# Altium schematic sheet Ethernet.SchDoc: Ethernet
size A3; DocumentNumber: MB1246; Revision: B.1; SheetNumber: 7; SheetTotal: 17; Project: STM32H7xxI-EVAL
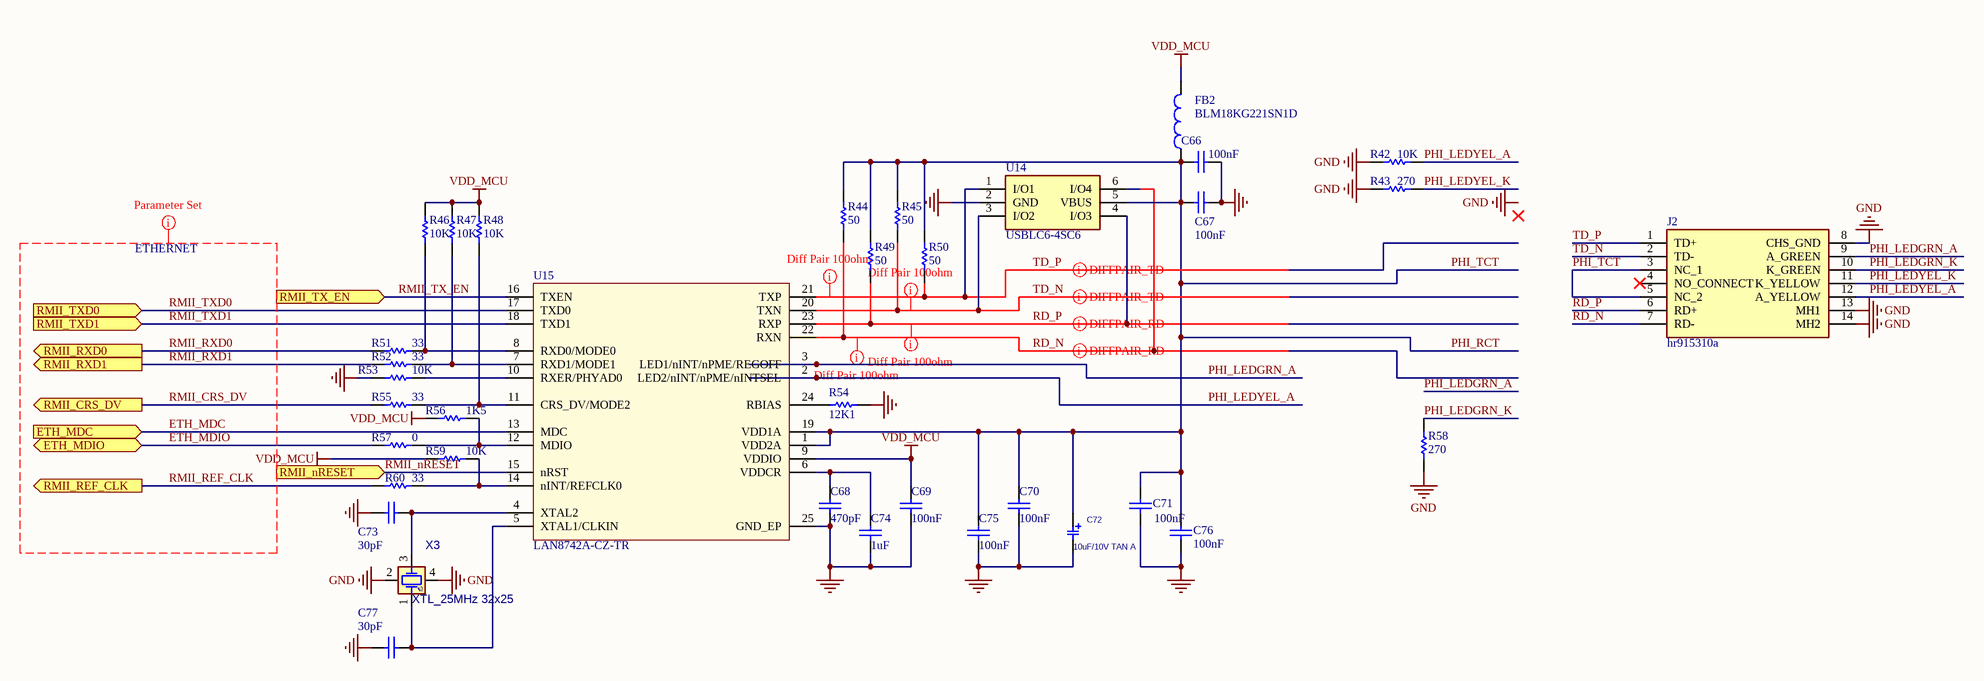
[diagram p0: Ethernet.SchDoc]

## Parts
C66  100nF  [C0603]
C67  100nF  [C0603]
C68  470pF  [C0603]
C69  100nF  [C0603]
C70  100nF  [C0603]
C71  100nF  [C0603]
C72  10uF/10V TAN A  [C_TN_3216]
C73  30pF  [C0603]
C74  1uF  [C0603]
C75  100nF  [C0603]
C76  100nF  [C0603]
C77  30pF  [C0603]
FB2  BLM18KG221SN1D  [L0603E]
J2  hr915310a  [hr915310a]
R42  10K  [R0603]
R43  270  [R0603]
R44  50  [R0603]
R45  50  [R0603]
R46  10K  [R0603]
R47  10K  [R0603]
R48  10K  [R0603]
R49  50  [R0603]
R50  50  [R0603]
R51  33  [R0603]
R52  33  [R0603]
R53  10K  [R0603]
R54  12K1  [R0603]
R55  33  [R0603]
R56  1K5  [R0603]
R57  0  [R0603]
R58  270  [R0603]
R59  10K  [R0603]
R60  33  [R0603]
U14  USBLC6-4SC6  [SOT95P280X145-6N]
U15  LAN8742A-CZ-TR  [QFN50P400X400X100-25N-D]
X3  XTL_25MHz 32x25  [XTL_4_3225]

## Ports
ETH_MDC (in), ETH_MDIO (bidir), RMII_CRS_DV (out), RMII_nRESET (in), RMII_REF_CLK (out), RMII_RXD0 (out), RMII_RXD1 (out), RMII_TX_EN (in), RMII_TXD0 (in), RMII_TXD1 (in)

## Nets
GND: C66.1 C67.1 C68.1 C69.1 C70.1 C71.1 C72.2 C73.2 C74.2 C75.1 C76.1 C77.2 J2.8(CHS_GND) J2.13(MH1) J2.14(MH2) R42.1 R43.1 R53.2 R54.2 R58.2 U14.2(GND) U15.25(GND_EP) X3.2(GND1) X3.4(GND2)
VDD_MCU: C69.2 FB2.2 R46.1 R47.1 R48.1 R56.2 R59.1 U15.9(VDDIO)
ETH_MDC: U15.13(MDC) ; port ETH_MDC
ETH_MDIO: R57.2 ; port ETH_MDIO
PHI_LEDGRN_A: J2.9(A_GREEN) U15.3(LED1/nINT/nPME/REGOFF)
PHI_LEDGRN_K: J2.10(K_GREEN) R58.1
PHI_LEDYEL_A: J2.12(A_YELLOW) R42.2 U15.2(LED2/nINT/nPME/nINTSEL)
PHI_LEDYEL_K: J2.11(K_YELLOW) R43.2
PHI_RCT: C66.2 C67.2 C70.2 C71.2 C72.1 C75.2 C76.2 FB2.1 J2.3(NC_1) J2.5(NC_2) R44.2 R45.2 R49.2 R50.2 U14.5(VBUS) U15.1(VDD2A) U15.19(VDD1A)  [also labelled PHI_TCT]
RD_N: J2.7(RD-) R44.1 U14.6(I/O4) U15.22(RXN)
RD_P: J2.6(RD+) R49.1 U14.4(I/O3) U15.23(RXP)
RMII_CRS_DV: R55.2 ; port RMII_CRS_DV
RMII_nRESET: U15.15(nRST) ; port RMII_nRESET
RMII_REF_CLK: R60.2 ; port RMII_REF_CLK
RMII_RXD0: R51.2 ; port RMII_RXD0
RMII_RXD1: R52.2 ; port RMII_RXD1
RMII_TX_EN: U15.16(TXEN) ; port RMII_TX_EN
RMII_TXD0: U15.17(TXD0) ; port RMII_TXD0
RMII_TXD1: U15.18(TXD1) ; port RMII_TXD1
TD_N: J2.2(TD-) R45.1 U14.3(I/O2) U15.20(TXN)
TD_P: J2.1(TD+) R50.1 U14.1(I/O1) U15.21(TXP)
NetC68_2: C68.2 C74.1 U15.6(VDDCR)
NetC73_1: C73.1 U15.4(XTAL2) X3.3(XB)
NetC77_1: C77.1 U15.5(XTAL1/CLKIN) X3.1(XA)
NetR46_2: R46.2 R51.1 U15.8(RXD0/MODE0)
NetR47_2: R47.2 R52.1 U15.7(RXD1/MODE1)
NetR48_2: R48.2 R55.1 U15.11(CRS_DV/MODE2)
NetR53_1: R53.1 U15.10(RXER/PHYAD0)
NetR54_1: R54.1 U15.24(RBIAS)
NetR56_1: R56.1 R57.1 U15.12(MDIO)
NetR59_2: R59.2 R60.1 U15.14(nINT/REFCLK0)

Not connected (* = marked no-connect by the designer): J2 4(NO_CONNECT)*

## Layout directives
differential pair: RD_N, RD_P, TD_N, TD_P
rule Matched Net Lengths [Tolerance = 100mil]: RD_N, RD_P, TD_N, TD_P
net class ETHERNET: ETH_MDC, ETH_MDIO, RMII_CRS_DV, RMII_REF_CLK, RMII_RXD0, RMII_RXD1, RMII_TXD0, RMII_TXD1

## Notes on the sheet
- Labels drawn without touching a wire or pin: GND
- Title:
- Project:
- Size:
- Date:
- A4
- Reference:
- Sheet:
- Revision:
- of

## Library data of the parts
C66 C67 C69-C71 C75 C76 = Capacitor_ST: Revision: July-2002: Re-released for DXP Platform.; Value: 100nF
C68 C73 C77 = Capacitor_ST: Value: 100nF; Revision: July-2002: Re-released for DXP Platform.
C72 = CAP_SMD_TAN_10uF_6.3V: CAP, SMD, TAN; PARAM: 20%, 300mOhm, -55~105oC; MANF: VISHAY; MANF_P#: T55A106M6R3C0300; PARAM2: 6.3V; VALUE: 10uF; PRICE: 0.46$
C74 = CAP SMD 0603  X5R 1µF 25V 10%: 0603  X5R 1µF; Rated voltage: 25V; Tolerance: 10%; Manufacturer: *; Manufacturer P/N: *; Order code Farnell: 1288202RL; Value: 1µF; Power: *; Technology: X5R; Temperature  Factor: *; Temperature Max: +125°C; Temperature Min: -55°C; STS Code: *
FB2 = Inductor: Ferrite Bead; Value: 100uH; Published: 8-Jun-2000; Revision: July-2002: Re-released for DXP Platform.; Publisher: Altium Limited
J2 = hr915310a: Manufacturer_Name: Hanrun Electronics; Datasheet Link: https://www.lcsc.com/datasheet/lcsc_datasheet_2411121057_HANRUN-Zhongshan-HanRun-Elec-HR915310A_C2760326.pdf; Height: 17.15mm; Manufacturer_Part_Number: hr915310a
R42 R46-R48 R53 R59 = Resistor_ST: Value: 10K
R43 R58 = Resistor_ST: Value: 10K
R44 R45 R49 R50 = Res_50_1%_0603: Manuf_Part_1: RC0402FR-0750RL; Manuf_1: YAGEO; Value: 50; Order: *; ECCN_US/EU: n/a; Distrib: FARNELL
R51 R52 R55 R60 = Res_33_1%_0402: Manuf_Part_1: RC0402FR-0733RL; Manuf_1: YAGEO; Value: 33; Order: *; ECCN_US/EU: n/a; Distrib: FARNELL
R54 = Res_12K1_1%_0603: Manuf_Part_1: MCT 0603-50 1% P5 12K1; Manuf_1: VISHAY; Order: 2325243; Value: 12K1; ECCN_US/EU: n/a; Distrib: FARNELL
R56 = Res_1K5_1%_0402: Manuf_Part_1: RC0402FR-071K5L; Manuf_1: YAGEO; Value: 1K5; Order: RC0402FR-071K5L; ECCN_US/EU: n/a; Distrib: FARNELL
R57 = Res1: Value: 1K; Published: 8-Jun-2000; Revision: July-2002: Re-released for DXP Platform.; Publisher: Altium Limited
U14 = USBLC6-4SC6: Integrated Circuit; Manufacturer_Name: STMicroelectronics; Datasheet Link: http://www.st.com/st-web-ui/static/active/en/resource/technical/document/datasheet/CD00047494.pdf; Height: 1.45mm; Manufacturer_Part_Number: USBLC6-4SC6; Mouser Part Number: 511-USBLC6-4SC6; Mouser Price/Stock: https://www.mouser.co.uk/ProductDetail/STMicroelectronics/USBLC6-4SC6?qs=k9dH%2Fx4GHJCNdehb8zInZg%3D%3D; Arrow Part Number: USBLC6-4SC6; Arrow Price/Stock: https://www.arrow.com/en/products/usblc6-4sc6/stmicroelectronics?region=europe
U15 = LAN8742A-CZ-TR: LAN8742A-CZ-TR - Small Footprint RMII 10/100 Ethernet, Transceiver with HP Auto-MDIX and flexPWR Technology SQFN-24; Manuf_1: MICROCHIP; Order: LAN8742A-CZ-TR; Manuf_Part_1: LAN8742A-CZ-TR; Distrib: MICROCHIP
X3 = XTL_4_25MHz_3225: CRYSTAL 25.00 MHZ 18pF, 10PPM; MANF: EPSON; DESC: DESCRIPTION; DIST#: MOUSER; PARAM2: PARAM; MANF_P#: TSX-3225 25.0000MF10P-C3; ASSEMBLY: ASSEMBLY; PARAM: 10PPM; PRICE: 0.5$; VALUE: 25MHz 32x25